# Altium schematic sheet RF.SchDoc
size A; SheetNumber: 4; SheetTotal: 7
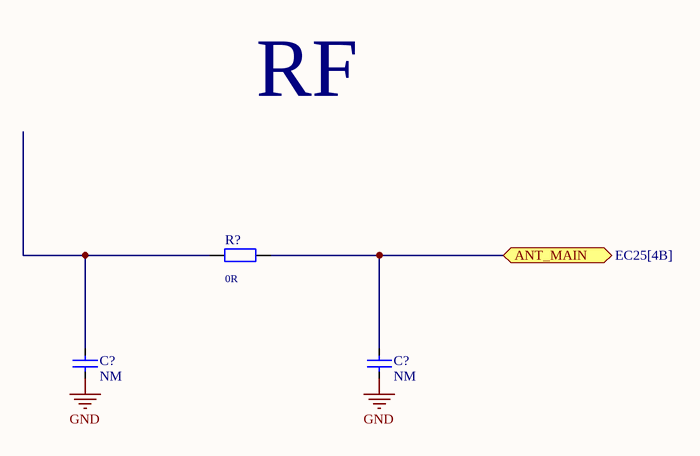
[diagram p0: RF.SchDoc]

## Parts
(Parts that share a designator on the sheet are numbered #1, #2 ... from top to bottom, then left to right.)
C?#1  value NM  [CAPC1005X06N]  (hidden comment: C)
C?#2  value NM  [CAPC1005X06N]  (hidden comment: C)
R?  value 0R  [RESC1005X04N]  (hidden comment: R)

## Ports
ANT_MAIN (bidir, see EC25[4B])

## Nets
GND: C?#1.1 C?#2.1
ANT_MAIN: C?#2.2 R?.2 ; port ANT_MAIN
NetC?#1_2: C?#1.2 R?.1

## Notes on the sheet
- RF

## Library data of the parts
C?#1 C?#2 = C: MPN: *; Link: *
R? = R: MPN: *; Link: *